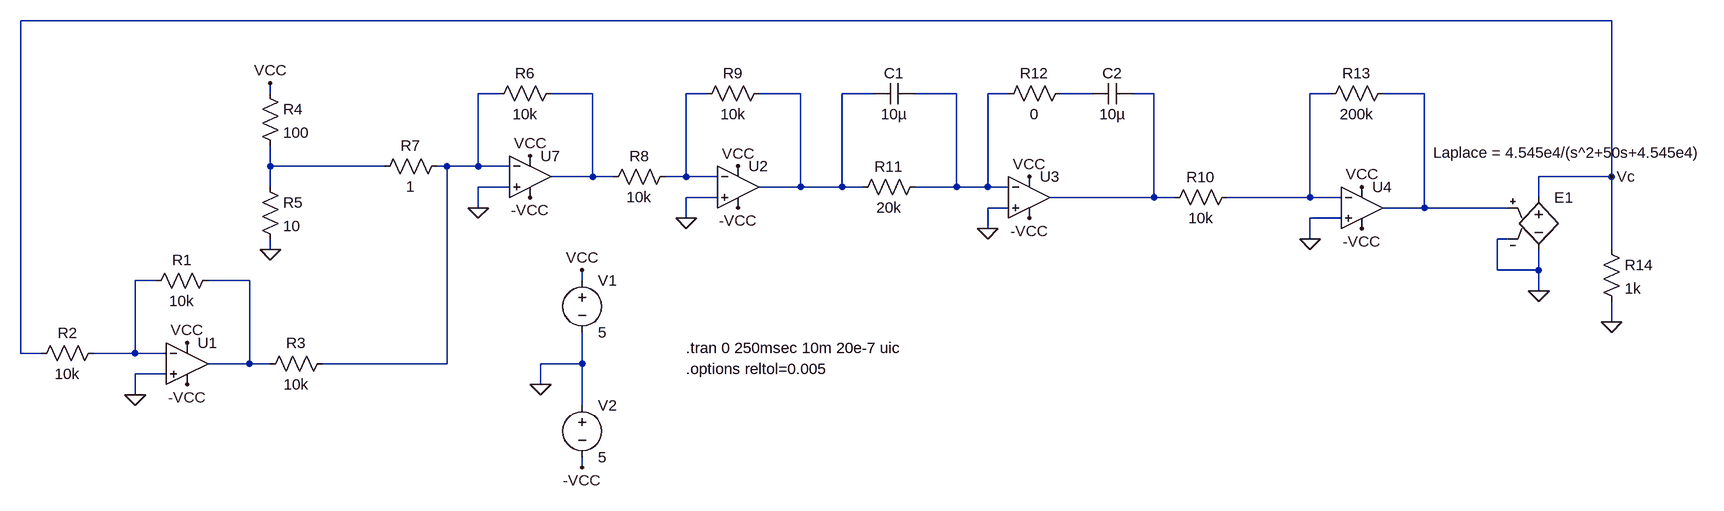
[diagram p0: schematic PID_FuncionTransferencia.asc]
PID_FuncionTransferencia.asc, the LTspice schematic file:
Version 4.1
SHEET 1 2408 680
WIRE 1872 -192 -576 -192
WIRE -192 -80 -192 -96
WIRE 160 -80 128 -80
WIRE 304 -80 240 -80
WIRE 480 -80 448 -80
WIRE 624 -80 560 -80
WIRE 736 -80 688 -80
WIRE 864 -80 800 -80
WIRE 944 -80 912 -80
WIRE 1072 -80 1024 -80
WIRE 1168 -80 1136 -80
WIRE 1440 -80 1408 -80
WIRE 1584 -80 1520 -80
WIRE -192 32 -192 0
WIRE -16 32 -192 32
WIRE 80 32 64 32
WIRE 128 32 128 -80
WIRE 128 32 80 32
WIRE 176 32 128 32
WIRE 304 48 304 -80
WIRE 304 48 240 48
WIRE 336 48 304 48
WIRE 448 48 448 -80
WIRE 448 48 416 48
WIRE 496 48 448 48
WIRE 1872 48 1872 -192
WIRE 1872 48 1760 48
WIRE -192 64 -192 32
WIRE 176 64 128 64
WIRE 624 64 624 -80
WIRE 624 64 560 64
WIRE 688 64 688 -80
WIRE 688 64 624 64
WIRE 720 64 688 64
WIRE 864 64 864 -80
WIRE 864 64 800 64
WIRE 912 64 912 -80
WIRE 912 64 864 64
WIRE 944 64 912 64
WIRE 496 80 448 80
WIRE 1168 80 1168 -80
WIRE 1168 80 1008 80
WIRE 1200 80 1168 80
WIRE 1408 80 1408 -80
WIRE 1408 80 1280 80
WIRE 1456 80 1408 80
WIRE 1760 80 1760 48
WIRE 128 96 128 64
WIRE 944 96 912 96
WIRE 1584 96 1584 -80
WIRE 1584 96 1520 96
WIRE 1712 96 1584 96
WIRE 448 112 448 80
WIRE 1456 112 1408 112
WIRE 912 128 912 96
WIRE 1408 144 1408 112
WIRE 1712 144 1696 144
WIRE -192 160 -192 144
WIRE 1872 160 1872 48
WIRE 1696 192 1696 144
WIRE 1760 192 1760 160
WIRE 1760 192 1696 192
WIRE -368 208 -400 208
WIRE -224 208 -288 208
WIRE 288 208 288 192
WIRE 1760 224 1760 192
WIRE 1872 272 1872 240
WIRE -576 320 -576 -192
WIRE -544 320 -576 320
WIRE -400 320 -400 208
WIRE -400 320 -464 320
WIRE -352 320 -400 320
WIRE -224 336 -224 208
WIRE -224 336 -288 336
WIRE -192 336 -224 336
WIRE 80 336 80 32
WIRE 80 336 -112 336
WIRE 288 336 288 288
WIRE 288 336 224 336
WIRE -352 352 -400 352
WIRE 224 368 224 336
WIRE -400 384 -400 352
WIRE 288 400 288 336
WIRE 288 496 288 480
FLAG -400 384 0
FLAG 224 368 0
FLAG 288 192 VCC
FLAG 288 496 -VCC
FLAG -320 304 VCC
FLAG -320 368 -VCC
FLAG -192 160 0
FLAG -192 -96 VCC
FLAG 128 96 0
FLAG 208 16 VCC
FLAG 208 80 -VCC
FLAG 448 112 0
FLAG 528 32 VCC
FLAG 528 96 -VCC
FLAG 912 128 0
FLAG 1408 144 0
FLAG 1488 64 VCC
FLAG 1488 128 -VCC
FLAG 976 48 VCC
FLAG 976 112 -VCC
FLAG 1760 224 0
FLAG 1872 272 0
FLAG 1872 48 Vc
SYMBOL OpAmps\\UniversalOpAmp2 -320 336 R0
SYMATTR InstName U1
SYMBOL res -272 192 R90
WINDOW 0 0 56 VBottom 2
WINDOW 3 32 56 VTop 2
SYMATTR InstName R1
SYMATTR Value 10k
SYMBOL res -448 304 R90
WINDOW 0 0 56 VBottom 2
WINDOW 3 32 56 VTop 2
SYMATTR InstName R2
SYMATTR Value 10k
SYMBOL res -96 320 R90
WINDOW 0 0 56 VBottom 2
WINDOW 3 32 56 VTop 2
SYMATTR InstName R3
SYMATTR Value 10k
SYMBOL voltage 288 192 R0
WINDOW 123 0 0 Left 0
WINDOW 39 0 0 Left 0
SYMATTR InstName V1
SYMATTR Value 5
SYMBOL voltage 288 384 R0
WINDOW 123 0 0 Left 0
WINDOW 39 0 0 Left 0
SYMATTR InstName V2
SYMATTR Value 5
SYMBOL res -208 -96 R0
SYMATTR InstName R4
SYMATTR Value 100
SYMBOL res -208 48 R0
SYMATTR InstName R5
SYMATTR Value 10
SYMBOL OpAmps\\UniversalOpAmp2 208 48 R0
SYMATTR InstName U7
SYMBOL res 256 -96 R90
WINDOW 0 0 56 VBottom 2
WINDOW 3 32 56 VTop 2
SYMATTR InstName R6
SYMATTR Value 10k
SYMBOL res 80 16 R90
WINDOW 0 0 56 VBottom 2
WINDOW 3 32 56 VTop 2
SYMATTR InstName R7
SYMATTR Value 1
SYMBOL res 432 32 R90
WINDOW 0 0 56 VBottom 2
WINDOW 3 32 56 VTop 2
SYMATTR InstName R8
SYMATTR Value 10k
SYMBOL OpAmps\\UniversalOpAmp2 528 64 R0
SYMATTR InstName U2
SYMBOL res 576 -96 R90
WINDOW 0 0 56 VBottom 2
WINDOW 3 32 56 VTop 2
SYMATTR InstName R9
SYMATTR Value 10k
SYMBOL res 816 48 R90
WINDOW 0 0 56 VBottom 2
WINDOW 3 32 56 VTop 2
SYMATTR InstName R11
SYMATTR Value 20k
SYMBOL cap 800 -96 R90
WINDOW 0 0 32 VBottom 2
WINDOW 3 32 32 VTop 2
SYMATTR InstName C1
SYMATTR Value 10µ
SYMBOL OpAmps\\UniversalOpAmp2 976 80 R0
SYMATTR InstName U3
SYMBOL res 1296 64 R90
WINDOW 0 0 56 VBottom 2
WINDOW 3 32 56 VTop 2
SYMATTR InstName R10
SYMATTR Value 10k
SYMBOL res 1040 -96 R90
WINDOW 0 0 56 VBottom 2
WINDOW 3 32 56 VTop 2
SYMATTR InstName R12
SYMATTR Value 0
SYMBOL cap 1136 -96 R90
WINDOW 0 0 32 VBottom 2
WINDOW 3 32 32 VTop 2
SYMATTR InstName C2
SYMATTR Value 10µ
SYMBOL OpAmps\\UniversalOpAmp2 1488 96 R0
SYMATTR InstName U4
SYMBOL res 1536 -96 R90
WINDOW 0 0 56 VBottom 2
WINDOW 3 32 56 VTop 2
SYMATTR InstName R13
SYMATTR Value 200k
SYMBOL e 1760 64 R0
WINDOW 3 -162 -53 Left 2
SYMATTR InstName E1
SYMATTR Value Laplace = 4.545e4/(s^2+50s+4.545e4)
SYMBOL res 1856 144 R0
SYMATTR InstName R14
SYMATTR Value 1k
TEXT 448 312 Left 2 !.tran 0 250msec 10m 20e-7 uic
TEXT 448 344 Left 2 !.options reltol=0.005

The netlist it stands for:
* PID_FuncionTransferencia.asc
X§U1 0 N011 VCC -VCC N012 level2 Avol=1Meg GBW=10Meg Slew=10Meg Ilimit=25m Rail=0 Vos=0 En=0 Enk=0 In=0 Ink=0 Rin=500Meg  ; pins In+ In- V+ V- OUT
R1 N012 N011 10k
R2 N011 Vc 10k
R3 N001 N012 10k
V1 VCC 0 5
V2 0 -VCC 5
R4 VCC N010 100
R5 N010 0 10
X§U7 0 N001 VCC -VCC N002 level2 Avol=1Meg GBW=10Meg Slew=10Meg Ilimit=25m Rail=0 Vos=0 En=0 Enk=0 In=0 Ink=0 Rin=500Meg  ; pins In+ In- V+ V- OUT
R6 N002 N001 10k
R7 N001 N010 1
R8 N003 N002 10k
X§U2 0 N003 VCC -VCC N004 level2 Avol=1Meg GBW=10Meg Slew=10Meg Ilimit=25m Rail=0 Vos=0 En=0 Enk=0 In=0 Ink=0 Rin=500Meg  ; pins In+ In- V+ V- OUT
R9 N004 N003 10k
R11 N005 N004 20k
C1 N005 N004 10µ
X§U3 0 N005 VCC -VCC N007 level2 Avol=1Meg GBW=10Meg Slew=10Meg Ilimit=25m Rail=0 Vos=0 En=0 Enk=0 In=0 Ink=0 Rin=500Meg  ; pins In+ In- V+ V- OUT
R10 N008 N007 10k
R12 N006 N005 0
C2 N007 N006 10µ
X§U4 0 N008 VCC -VCC N009 level2 Avol=1Meg GBW=10Meg Slew=10Meg Ilimit=25m Rail=0 Vos=0 En=0 Enk=0 In=0 Ink=0 Rin=500Meg  ; pins In+ In- V+ V- OUT
R13 N009 N008 200k
E1 Vc 0 N009 0 Laplace = 4.545e4/(s^2+50s+4.545e4)
R14 Vc 0 1k
.tran 0 250msec 10m 20e-7 uic
.options reltol=0.005
.lib UniversalOpAmp2.lib
.backanno
.end